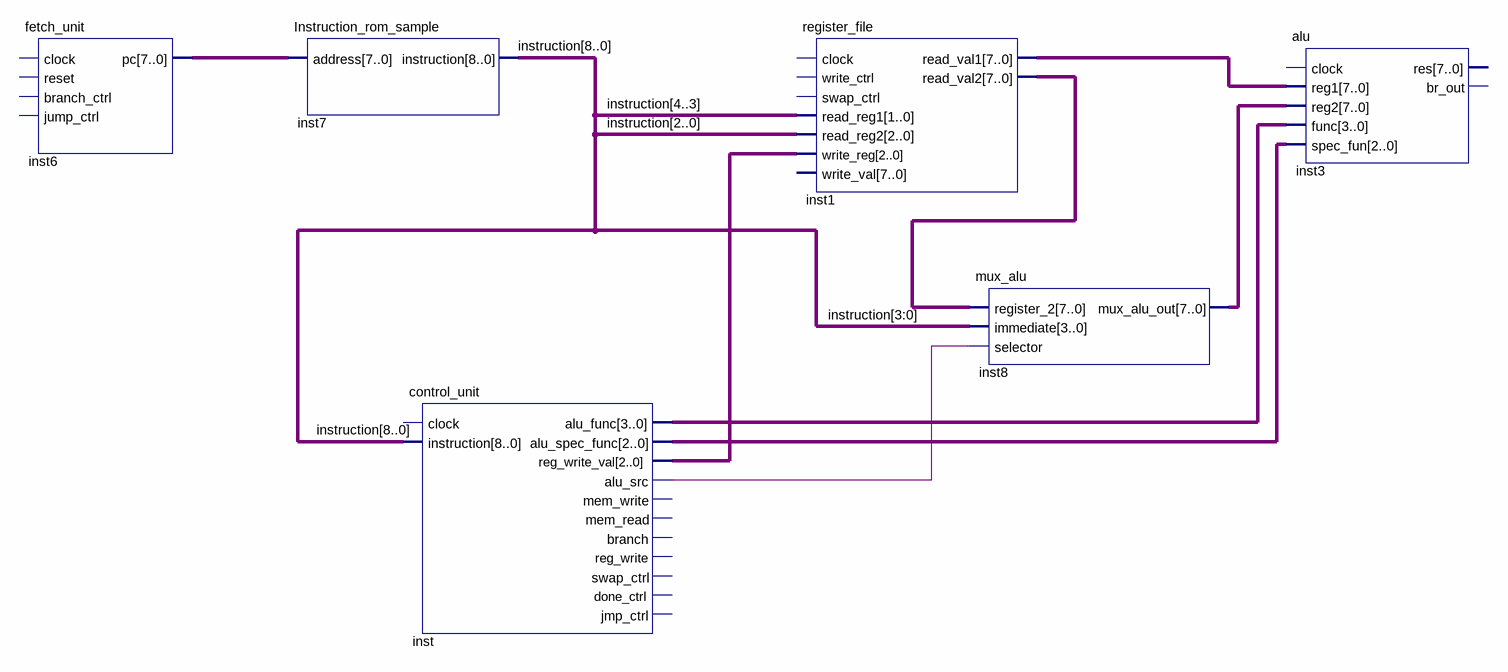
[diagram p0: schematic sheet]
// Quartus schematic Lab3.bdf as structural Verilog: 6 symbols, 0 pins
module Lab3 (
);

  wire inst_alu_src;
  wire [2:0] inst_alu_spec_func, inst_reg_write_val;
  wire [3:0] inst_alu_func;
  wire [7:0] inst1_read_val1, inst1_read_val2, inst6_pc, inst8_mux_alu_out;
  wire [8:0] instruction;

  fetch_unit inst6 (.pc(inst6_pc));  // open: clock, reset, branch_ctrl, jump_ctrl
  Instruction_rom_sample inst7 (.address(inst6_pc), .instruction(instruction));
  control_unit inst (
    .instruction(instruction), .alu_func(inst_alu_func), .alu_spec_func(inst_alu_spec_func),
    .reg_write_val(inst_reg_write_val), .alu_src(inst_alu_src));  // open: clock, mem_write, mem_read, branch, reg_write, swap_ctrl, done_ctrl, jmp_ctrl
  register_file inst1 (
    .read_reg1(instruction[4:3]), .read_reg2(instruction[2:0]), .write_reg(inst_reg_write_val),
    .read_val1(inst1_read_val1), .read_val2(inst1_read_val2));  // open: clock, write_ctrl, swap_ctrl, write_val
  mux_alu inst8 (
    .register_2(inst1_read_val2), .immediate(instruction[3:0]), .selector(inst_alu_src),
    .mux_alu_out(inst8_mux_alu_out));
  alu inst3 (
    .reg1(inst1_read_val1), .reg2(inst8_mux_alu_out), .func(inst_alu_func), .spec_fun(inst_alu_spec_func));  // open: clock, res, br_out
endmodule
